# EAGLE design munia-snes (EAGLE 8.2.2)

## Sheet 1 of 4: MCU
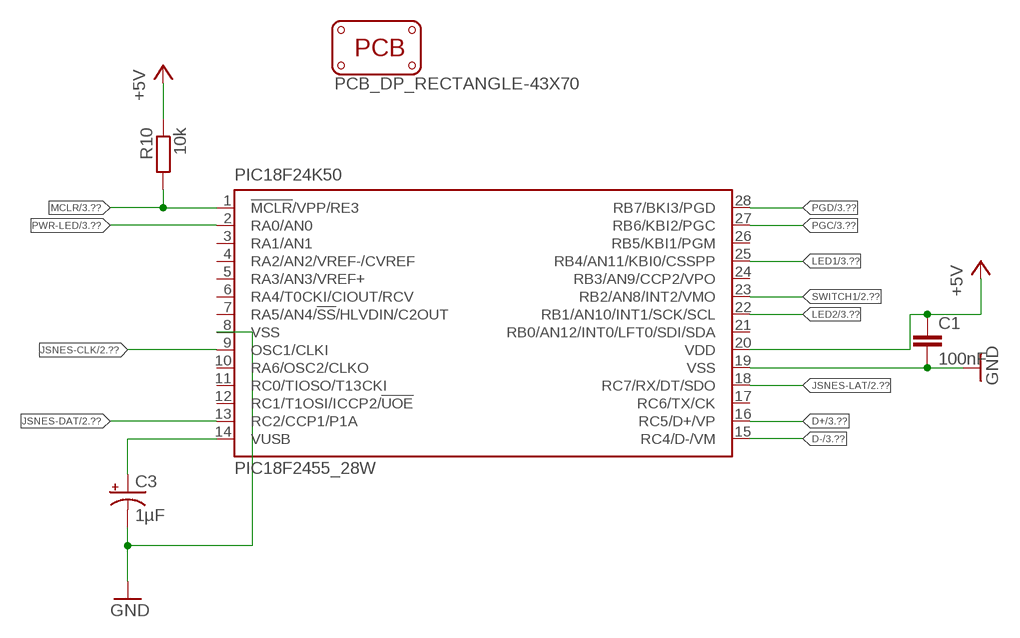
[diagram p0: schematic, sheet 1]

### Parts
C1  100nF  C-EUC0603  [C0603]
C3  1µF  TANT-CAP1206  [EIA3216]
PCB1  PCB_DP_RECTANGLE-43X70  [DP7043_V1]
PIC18F24K50  PIC18F2455_28W  [SO28W]
R10  10k  R-EU_R0603  [R0603]

### Nets
+5V: C1.1 PIC18F24K50.20(VDD) R10.1 ; also sheet 2,3,4
D+: PIC18F24K50.16(RC5/D+/VP) ; also sheet 3
D-: PIC18F24K50.15(RC4/D-/VM) ; also sheet 3
GND: C1.2 C3.C(-) PIC18F24K50.8(VSS) PIC18F24K50.19(VSS) ; also sheet 2,3
JSNES-CLK: PIC18F24K50.9(OSC1/CLKI) ; also sheet 2,3
JSNES-DAT: PIC18F24K50.13(RC2/CCP1/P1A) ; also sheet 2,3
JSNES-LAT: PIC18F24K50.18(RC7/RX/DT/SDO) ; also sheet 2,3
LED1: PIC18F24K50.25(RB4/AN11/KBI0/CSSPP) ; also sheet 3
LED2: PIC18F24K50.22(RB1/AN10/INT1/SCK/SCL) ; also sheet 3
MCLR: PIC18F24K50.1(!MCLR!/VPP/RE3) R10.2 ; also sheet 3
N$2: C3.A(+) PIC18F24K50.14(VUSB)
PGC: PIC18F24K50.27(RB6/KBI2/PGC) ; also sheet 3
PGD: PIC18F24K50.28(RB7/BKI3/PGD) ; also sheet 3
PWR-LED: PIC18F24K50.2(RA0/AN0) ; also sheet 3
SWITCH1: PIC18F24K50.23(RB2/AN8/INT2/VMO) ; also sheet 2
Unconnected: PIC18F24K50.3(RA1/AN1) PIC18F24K50.4(RA2/AN2/VREF-/CVREF) PIC18F24K50.5(RA3/AN3/VREF+) PIC18F24K50.6(RA4/T0CKI/CIOUT/RCV) PIC18F24K50.7(RA5/AN4/!SS!/HLVDIN/C2OUT) PIC18F24K50.10(RA6/OSC2/CLKO) PIC18F24K50.11(RC0/TIOSO/T13CKI) PIC18F24K50.12(RC1/T1OSI/ICCP2/!UOE) PIC18F24K50.17(RC6/TX/CK) PIC18F24K50.21(RB0/AN12/INT0/LFT0/SDI/SDA) PIC18F24K50.24(RB3/AN9/CCP2/VPO) PIC18F24K50.26(RB5/KBI1/PGM)

## Sheet 2 of 4: SIGNALS
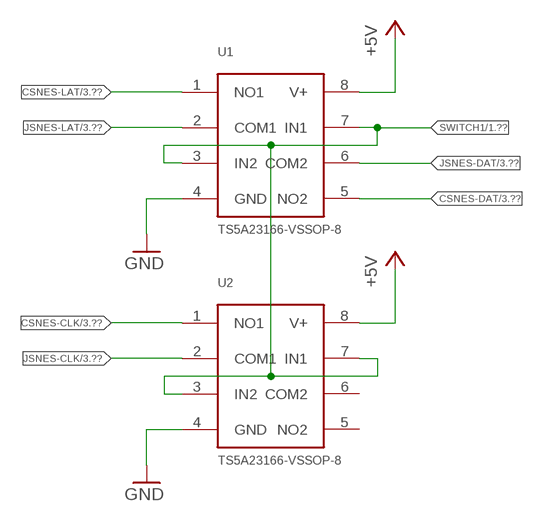
[diagram p1: schematic, sheet 2]

### Parts
U1  TS5A23166-VSSOP-8  [SOT765]
U2  TS5A23166-VSSOP-8  [SOT765]

### Nets
+5V: U1.8(V+) U2.8(V+) ; also sheet 1,3,4
CSNES-CLK: U2.1(NO1) ; also sheet 3
CSNES-DAT: U1.5(NO2) ; also sheet 3
CSNES-LAT: U1.1(NO1) ; also sheet 3
GND: U1.4(GND) U2.4(GND) ; also sheet 1,3
JSNES-CLK: U2.2(COM1) ; also sheet 1,3
JSNES-DAT: U1.6(COM2) ; also sheet 1,3
JSNES-LAT: U1.2(COM1) ; also sheet 1,3
SWITCH1: U1.3(IN2) U1.7(IN1) U2.3(IN2) U2.7(IN1) ; also sheet 1
Unconnected: U2.5(NO2) U2.6(COM2)

## Sheet 3 of 4: CONNECTORS
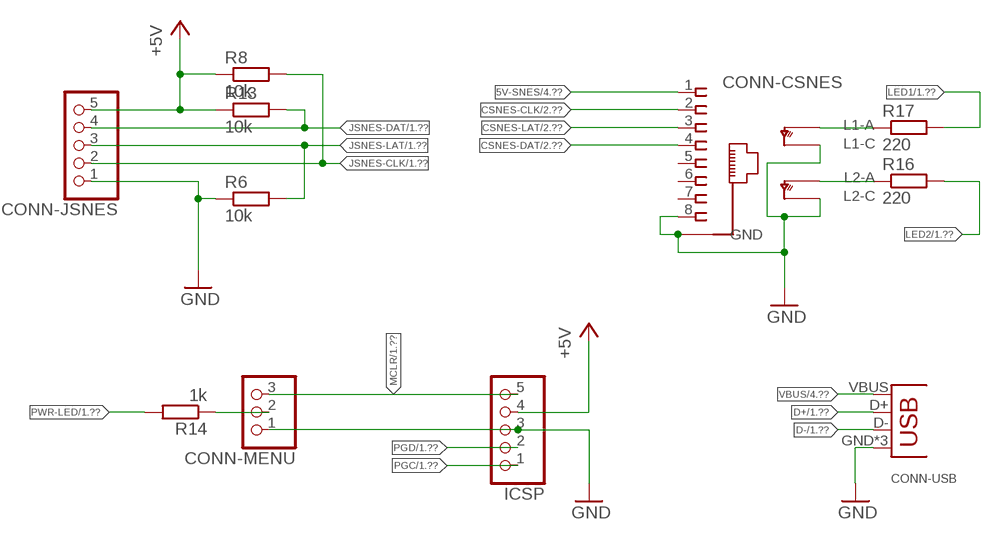
[diagram p2: schematic, sheet 3]

### Parts
CONN-CSNES  RJ45-NIELS  [RJ45-NIELS]
CONN-JSNES  PINHD-1X5  [1X05]
CONN-MENU  PINHD-1X3  [1X03]
CONN-USB  USB-B-NIELS  [USB-B-H]
ICSP  PINHD-1X5  [1X05]
R6  10k  R-EU_R0603  [R0603]
R8  10k  R-EU_R0603  [R0603]
R13  10k  R-EU_R0603  [R0603]
R14  1k  R-EU_R0603  [R0603]
R16  220  R-EU_R0603  [R0603]
R17  220  R-EU_R0603  [R0603]

### Nets
5V-SNES: CONN-CSNES.1 ; also sheet 4
+5V: CONN-JSNES.5 ICSP.4 R8.1 R13.1 ; also sheet 1,2,4
CSNES-CLK: CONN-CSNES.2 ; also sheet 2
CSNES-DAT: CONN-CSNES.4 ; also sheet 2
CSNES-LAT: CONN-CSNES.3 ; also sheet 2
D+: CONN-USB.D+ ; also sheet 1
D-: CONN-USB.D- ; also sheet 1
GND: CONN-CSNES.8 CONN-CSNES.GND@5(GND) CONN-CSNES.GND@6(GND) CONN-CSNES.LED-GREEN-C(L2C) CONN-CSNES.LED-ORANGE-C(L1C) CONN-JSNES.1 CONN-MENU.1 CONN-USB.GND CONN-USB.GND@1(GND) CONN-USB.GND@2(GND) ICSP.3 R6.1 ; also sheet 1,2
JSNES-CLK: CONN-JSNES.2 R8.2 ; also sheet 1,2
JSNES-DAT: CONN-JSNES.4 R13.2 ; also sheet 1,2
JSNES-LAT: CONN-JSNES.3 R6.2 ; also sheet 1,2
LED1: R17.2 ; also sheet 1
LED2: R16.2 ; also sheet 1
MCLR: CONN-MENU.3 ICSP.5 ; also sheet 1
N$1: CONN-MENU.2 R14.1
N$4: CONN-CSNES.LED-ORANGE-A(L1A) R17.1
N$5: CONN-CSNES.LED-GREEN-A(L2A) R16.1
PGC: ICSP.1 ; also sheet 1
PGD: ICSP.2 ; also sheet 1
PWR-LED: R14.2 ; also sheet 1
VBUS: CONN-USB.VBUS ; also sheet 4
Unconnected: CONN-CSNES.5 CONN-CSNES.6 CONN-CSNES.7

## Sheet 4 of 4: POWER
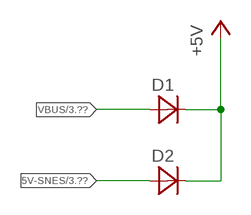
[diagram p3: schematic, sheet 4]

### Parts
D1  MBR120VLSFT1G  [SOD123]
D2  MBR120VLSFT1G  [SOD123]

### Nets
5V-SNES: D2.2(A) ; also sheet 3
+5V: D1.1(C) D2.1(C) ; also sheet 1,2,3
VBUS: D1.2(A) ; also sheet 3

## Library data of the parts
C1 = resistor:C-EU: CAPACITOR, European symbol
C3 = Spark:TANT-CAP: Tantalum SMT
CONN-CSNES = frank:RJ45-NIELS
CONN-JSNES ICSP = pinhead:PINHD-1X5: PIN HEADER
CONN-MENU = pinhead:PINHD-1X3: PIN HEADER
CONN-USB = frank:USB: USB Connectors
D1 D2 = frank:MBR120VLSFT1G: DIODE, SCHOTTKY, 1A, 20V, SOD-123FL
PCB1 = dp_pcb:PCB_DP_RECTANGLE: Dangerous Prototypes Standard Rectangular PCB sizes
PIC18F24K50 = microchip:PIC18F2*_28: USB Microcontrollers with nanoWatt Technology High-Performance, Enhanced Flash, 28/40/44-Pin, Source: http://ww1.microchip.com/downloads/en/devicedoc/39632c.pdf; MF: MICROCHIP; MPN: PIC18F2455-I/SO; OC_FARNELL: 1579598; OC_NEWARK: 64J3768
R6 R8 R10 R13 R14 R16 R17 = resistor:R-EU_: RESISTOR, European symbol
U1 U2 = frank:TS5A23166

## Net classes
0 default: width 0.152 mm, drill 0.25 mm, clearance 0.152 mm

## Board
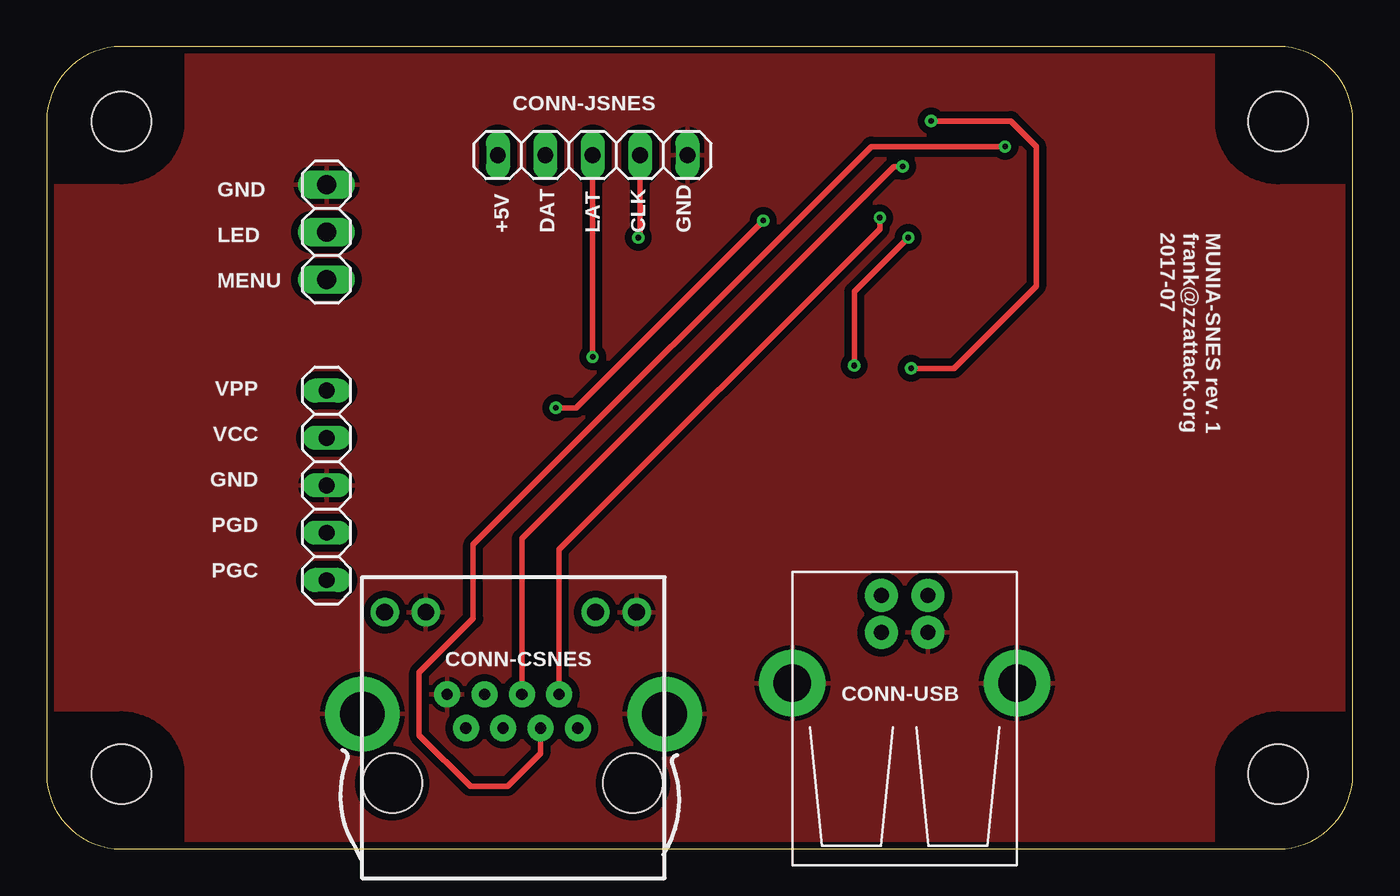
[diagram p4: board, top side]
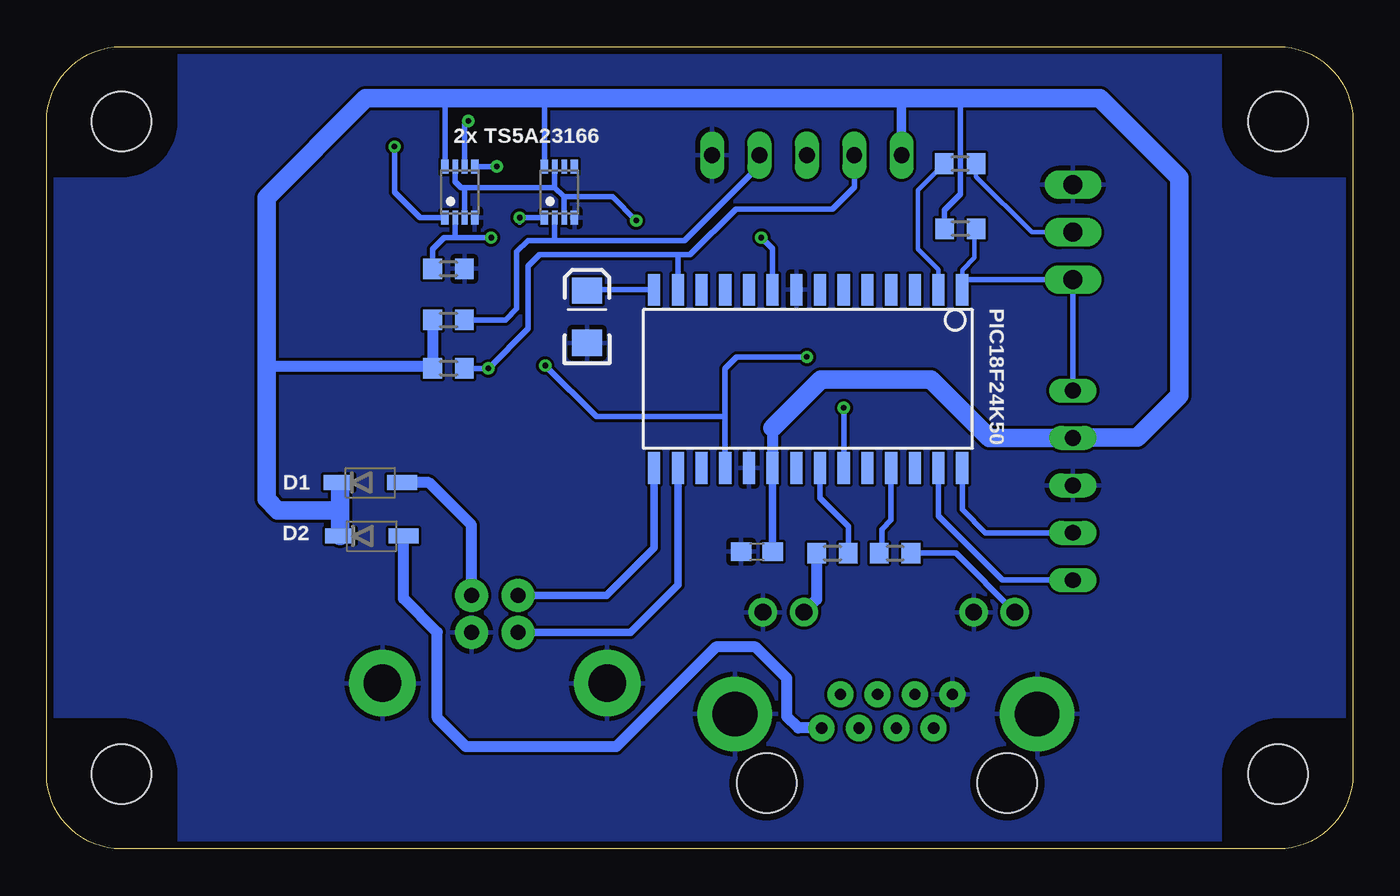
[diagram p5: board, bottom side, seen from below]

Size 70 x 43 mm. Coordinates in mm from the lower left corner, seen from the top.
Copper layers (1*16): Top 0.0356mm / dielectric 1.5011mm / Bottom 0.0356mm
Design rules "pcbway 6mil 0.3mm drills *": minimum track width 6mil, minimum drill 0.3mm, track to track 6mil, track to pad 6mil, pad to pad 6mil, via to via 6mil, smd to smd 6mil, copper to edge 15mil, drill to drill 6mil, minimum pad ring 7mil, minimum via ring 7mil, stop-mask expansion 4mil, vias tented up to drill 999mil, thermal gap 10mil

### Footprints (pad centres in the part's own frame; a part is rotated, then mirrored left to right if it is on the bottom)
C0603 = smd 1.1 x 1: 1 -0.85,0; 2 0.85,0
EIA3216 = smd 1.4 x 1.6: A 1.4,0; C -1.4,0
RJ45-NIELS = drill 0.6 pad 1.397: 1 3.93,-0.84; 2 2.93,0.96; 3 1.93,-0.84; 4 0.93,0.96; 5 -0.07,-0.84; 6 -1.07,0.96; 7 -2.07,-0.84; 8 -3.07,0.96 | drill 2.4 pad 4: GND@5 -7.62,-0.09; GND@6 8.58,-0.09 | drill 0.9 pad 1.524: LED-GREEN-A 4.88,5.37; LED-GREEN-C 7.08,5.37; LED-ORANGE-A -6.42,5.37; LED-ORANGE-C -4.22,5.37 | hole 3.2: -6.02,-3.79; 6.88,-3.79
1X05 = drill 0.85 long: 1 -5.08,0; 2 -2.54,0; 3 0,0; 4 2.54,0; 5 5.08,0
1X03 = drill 1.016 long: 1 -2.54,0; 2 0,0; 3 2.54,0
USB-B-H = drill 0.8 pad 1.778: D+ 0,1.25; D- 1.981,1.25; GND 0,-1.25; VBUS 1.981,-1.25 | drill 2 pad 3.556: GND@1 -2.718,-6.02; GND@2 -2.718,6.02
SOD123 = smd 1.6 x 0.8: 1 -1.7,0; 2 1.7,0
DP7043_V1 = hole 3.2: 4,4; 66,4; 66,39; 4,39
SO28W = smd 0.65 x 1.7: 1 -7.62,-4.78; 2 -6.35,-4.78; 3 -5.08,-4.78; 4 -3.81,-4.78; 5 -2.54,-4.78; 6 -1.27,-4.78; 7 0,-4.78; 8 1.27,-4.78; 9 2.54,-4.78; 10 3.81,-4.78; 11 5.08,-4.78; 12 6.35,-4.78; 13 7.62,-4.78; 14 8.89,-4.78; 15 8.89,4.78; 16 7.62,4.78; 17 6.35,4.78; 18 5.08,4.78; 19 3.81,4.78; 20 2.54,4.78; 21 1.27,4.78; 22 0,4.78; 23 -1.27,4.78; 24 -2.54,4.78; 25 -3.81,4.78; 26 -5.08,4.78; 27 -6.35,4.78; 28 -7.62,4.78
R0603 = smd 1 x 1.1: 1 -0.85,0; 2 0.85,0
SOT765 = smd 0.4 x 0.75: 1 -0.8,-1.375; 4 0.8,-1.375; 5 0.8,1.375; 8 -0.8,1.375 | smd 0.3 x 0.75: 2 -0.25,-1.375; 3 0.25,-1.375; 6 0.25,1.375; 7 -0.25,1.375

### Placement (x,y rotation side)
C1  31.94,15.93 180 bottom
C3  41.04,28.52 90 bottom
CONN-CSNES  24.54,7.32 0 top
CONN-JSNES  29.26,37.19 180 top
CONN-MENU  15,33.06 270 top
CONN-USB  45.98,11.6 90 top
D1  52.65,19.63 0 bottom
D2  52.58,16.76 0 bottom
ICSP  15,19.49 90 top
PCB1  0,0 0 top
PIC18F24K50  28.55,25.19 180 bottom
R6  48.46,31.09 180 bottom
R8  48.46,28.35 0 bottom
R10  21.03,33.24 0 bottom
R13  48.46,25.76 0 bottom
R14  21.04,36.73 180 bottom
R16  27.89,15.85 0 bottom
R17  24.54,15.85 180 bottom
U1  47.85,35.2 0 bottom
U2  42.52,35.2 0 bottom

### Tracks (layer width: path | path; a pad name or v marks a point on that pad's centre or on a via)
5V-SNES
  Bottom 0.6: CONN-CSNES.1 29.72,6.47 30.33,7.08 30.33,9.14 32,10.82 34.14,10.82 39.47,5.49 47.55,5.49 49.07,7.01 49.07,11.61 50.88,13.41 D2.2
+5V
  Bottom 0.305: R10.1 21.88,34.24 21.03,35.09 21.03,40.15 21.12,40.23 | 24.18,39.98 24.43,40.23 | U1.8 48.65,40.08 48.5,40.23 | U2.8 43.32,40.04 43.52,40.23
  Bottom 0.406: C1.1 31.09,16.7 PIC18F24K50.20
  Bottom 0.508: 14.97,22.05 ICSP.4 | CONN-JSNES.5 24.18,39.98
  Bottom 0.6: 31.09,22.55 PIC18F24K50.20 | R8.1 R13.1 49.4,25.84 58.22,25.84 | 58.21,27.43 58.22,27.43 | D1.1 54.28,19.56
  Bottom 1: 14.97,22.05 11.55,22.05 9.3,24.3 9.3,35.97 13.56,40.23 21.12,40.23 24.43,40.23 43.52,40.23 48.5,40.23 52.9,40.23 58.22,34.92 58.22,27.43 58.22,25.84 58.22,18.75 57.61,18.14 54.28,18.14 | ICSP.4 19.48,22.02 22.61,25.15 28.5,25.15 31.09,22.55 | 54.28,19.56 54.28,18.14 | 54.28,18.14 D2.1
CSNES-CLK  (via drill 0.3)
  Top 0.305: CONN-CSNES.2 27.47,16.04 44.65,33.22 v44.65,33.83
  Bottom 0.305: v44.65,33.83 | v44.65,33.83 U2.1 | 44.65,33.6 v44.65,33.83
CSNES-DAT  (via drill 0.3)
  Top 0.305: CONN-CSNES.4 25.47,16.63 45.26,36.42 45.41,36.58 v45.87,36.58
  Bottom 0.305: v45.87,36.58 v45.88,36.58 U1.5
CSNES-LAT  (via drill 0.3)
  Top 0.305: CONN-CSNES.3 26.47,5.13 24.69,3.35 22.71,3.35 19.96,6.1 19.96,9.45 22.86,12.34 22.86,16.31 44.2,37.64 v51.36,37.64
  Bottom 0.305: v51.36,37.64 51.36,35.2 49.99,33.83 U1.1
D+
  Bottom 0.406: PIC18F24K50.16 36.17,14.14 38.71,11.6 CONN-USB.D+
D-
  Bottom 0.406: PIC18F24K50.15 37.44,16.12 39.98,13.58 CONN-USB.D-
GND
  pour Top (isolate 0.381): 0,0 0,43 70,43 70,0
  pour Bottom: 0,0 70,0 70,43 0,43
JSNES-CLK  (via drill 0.3)
  Top 0.305: v31.7,32.77 31.8,32.87 CONN-JSNES.2
  Bottom 0.305: PIC18F24K50.9 31.09,32.16 v31.7,32.77 | 42.73,32.61 44.2,32.61 44.81,32 44.81,28.96 45.41,28.35 R8.2 | 42.73,32.61 35.81,32.61 31.8,36.63 CONN-JSNES.2 | 42.73,32.61 42.77,32.65 U2.2
JSNES-DAT  (via drill 0.3)
  Top 0.305: v47.4,39.01 51.66,39.01 53.03,37.64 53.03,30.18 48.62,25.76 v46.33,25.76
  Bottom 0.305: U1.6 47.6,38.81 v47.4,39.01 | R13.2 v46.33,25.76 44.2,27.89 44.2,31.24 43.59,31.85 36.24,31.85 | CONN-JSNES.4 26.72,35.46 27.89,34.29 33.07,34.29 35.51,31.85 36.24,31.85 | PIC18F24K50.13 36.17,31.78 36.24,31.85
JSNES-LAT  (via drill 0.3)
  Top 0.305: v29.26,26.36 CONN-JSNES.3 | v43.28,25.91 43.28,29.87 v46.18,32.77
  Bottom 0.305: PIC18F24K50.18 33.63,23.16 | 33.63,23.16 33.63,25.76 33.02,26.36 v29.26,26.36 | 33.63,23.16 40.54,23.16 v43.28,25.91 | 48.11,32.77 48.7,32.77 49.31,32.16 R6.2 | 48.11,32.77 v46.18,32.77 | 48.11,32.77 48.1,32.77 U1.2
LED1
  Bottom 0.305: 24.84,20.31 arc90 PIC18F24K50.25 24.74,17.62 25.23,17.13 25.23,16 R17.2
LED2
  Bottom 0.305: PIC18F24K50.22 28.55,18.8 27.04,17.29 R16.2
MCLR
  Bottom 0.254: 20.18,30.53 20.2,30.5 | PIC18F24K50.1 20.93,31.03 20.27,31.7 20.27,33.16 R10.2
  Bottom 0.305: ICSP.5 CONN-MENU.3 | PIC18F24K50.1 20.93,30.5 20.2,30.5 15.01,30.5 CONN-MENU.3 | CONN-MENU.3 15.02,30.53
N$1
  Bottom 0.254: CONN-MENU.2 17.21,33.06 20.19,36.04 R14.1
N$2
  Bottom 0.305: PIC18F24K50.14 41,29.97 C3.A
N$4
  Bottom 0.305: CONN-CSNES.LED-ORANGE-A 21.28,15.85 R17.1
N$5
  Bottom 0.6: R16.1 28.74,13.36 CONN-CSNES.LED-GREEN-A
PGC
  Bottom 0.305: PIC18F24K50.27 22.2,17.84 18.77,14.4 ICSP.1
PGD
  Bottom 0.305: PIC18F24K50.28 20.93,18.19 19.69,16.95 ICSP.2
PWR-LED
  Bottom 0.254: R14.2 23.32,35.3 23.32,32.16 22.2,31.04 PIC18F24K50.2
SWITCH1  (via drill 0.3)
  Top 0.305: v38.41,33.68 28.36,23.64 v27.28,23.64
  Bottom 0.305: 42.77,35.45 U2.7 | U2.3 42.27,34.95 | 42.77,35.45 42.27,34.95 | U1.7 48.1,35.76 47.8,35.45 47.53,35.45 | 47.53,35.45 42.77,35.45 | U1.3 47.6,35.38 47.53,35.45 | 42.27,34.95 39.68,34.95 v38.41,33.68 | PIC18F24K50.23 v27.28,23.64
VBUS
  Bottom 0.6: CONN-USB.VBUS 47.23,17.36 49.51,19.63 D1.2

### Text on the board
tNames: +5V / / DAT / / LAT / / CLK / / GND | MUNIA-SNES rev. 1 / frank@zzattack.org / 2017-07 | GND / / LED / / MENU | VPP / / VCC / / GND / / PGD / / PGC
bNames: 2x TS5A23166